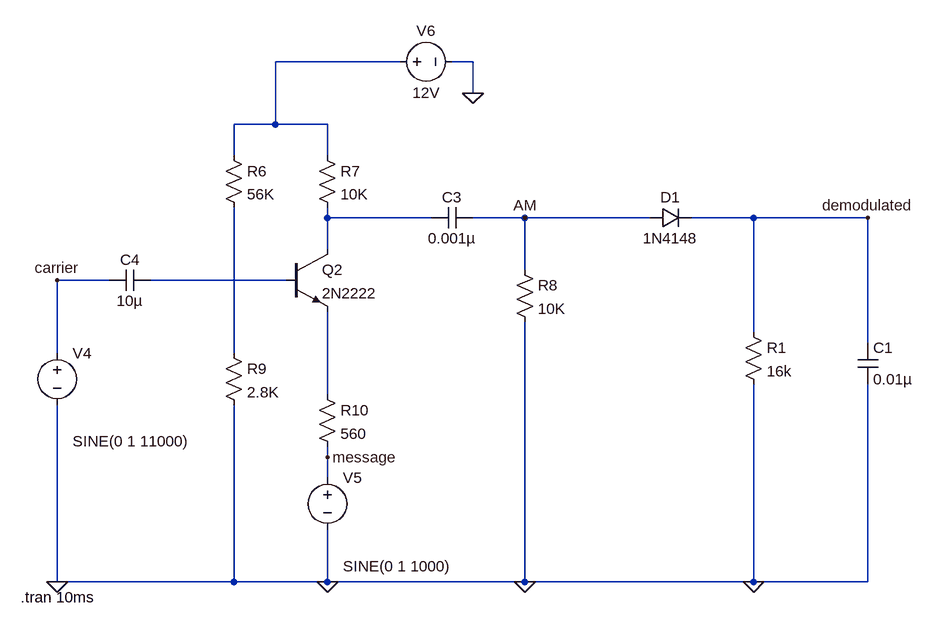
[diagram p0: schematic AM using envelope.asc]
AM using envelope.asc, the LTspice schematic file:
Version 4
SHEET 1 1700 776
WIRE 128 -1488 -64 -1488
WIRE 240 -1488 208 -1488
WIRE 240 -1440 240 -1488
WIRE -64 -1392 -64 -1488
WIRE -64 -1392 -128 -1392
WIRE 16 -1392 -64 -1392
WIRE -128 -1344 -128 -1392
WIRE 16 -1344 16 -1392
WIRE 16 -1248 16 -1264
WIRE 176 -1248 16 -1248
WIRE 320 -1248 240 -1248
WIRE 512 -1248 320 -1248
WIRE 672 -1248 576 -1248
WIRE 848 -1248 672 -1248
WIRE 16 -1200 16 -1248
WIRE 320 -1168 320 -1248
WIRE -320 -1152 -400 -1152
WIRE -48 -1152 -256 -1152
WIRE 672 -1072 672 -1248
WIRE 848 -1056 848 -1248
WIRE -400 -1040 -400 -1152
WIRE -128 -1040 -128 -1264
WIRE 16 -976 16 -1104
WIRE 16 -880 16 -896
WIRE 16 -848 16 -880
WIRE -400 -688 -400 -960
WIRE -128 -688 -128 -960
WIRE -128 -688 -400 -688
WIRE 16 -688 16 -768
WIRE 16 -688 -128 -688
WIRE 320 -688 320 -1088
WIRE 320 -688 16 -688
WIRE 672 -688 672 -992
WIRE 672 -688 320 -688
WIRE 848 -688 848 -992
WIRE 848 -688 672 -688
FLAG 240 -1440 0
FLAG -400 -688 0
FLAG 16 -688 0
FLAG 320 -688 0
FLAG 320 -1248 AM
FLAG 16 -880 message
FLAG -400 -1152 carrier
FLAG 672 -688 0
FLAG 848 -1248 demodulated
SYMBOL res -144 -1360 R0
SYMATTR InstName R6
SYMATTR Value 56K
SYMBOL res 0 -1360 R0
SYMATTR InstName R7
SYMATTR Value 10K
SYMBOL npn -48 -1200 R0
SYMATTR InstName Q2
SYMATTR Value 2N2222
SYMBOL cap 240 -1264 R90
WINDOW 0 0 32 VBottom 2
WINDOW 3 32 32 VTop 2
SYMATTR InstName C3
SYMATTR Value 0.001µ
SYMBOL res 304 -1184 R0
SYMATTR InstName R8
SYMATTR Value 10K
SYMBOL res -144 -1056 R0
SYMATTR InstName R9
SYMATTR Value 2.8K
SYMBOL cap -256 -1168 R90
WINDOW 0 0 32 VBottom 2
WINDOW 3 32 32 VTop 2
SYMATTR InstName C4
SYMATTR Value 10µ
SYMBOL voltage -400 -1056 R0
WINDOW 3 24 152 Left 2
WINDOW 123 24 124 Left 2
WINDOW 39 0 0 Left 0
SYMATTR Value SINE(0 1 11000)
SYMATTR InstName V4
SYMBOL voltage 16 -864 R0
WINDOW 3 24 152 Left 2
WINDOW 123 24 124 Left 2
WINDOW 39 0 0 Left 0
SYMATTR Value SINE(0 1 1000)
SYMATTR InstName V5
SYMBOL res 0 -992 R0
SYMATTR InstName R10
SYMATTR Value 560
SYMBOL voltage 112 -1488 R270
WINDOW 0 32 56 VTop 2
WINDOW 3 -32 56 VBottom 2
WINDOW 123 0 0 Left 0
WINDOW 39 0 0 Left 0
SYMATTR InstName V6
SYMATTR Value 12V
SYMBOL diode 512 -1232 R270
WINDOW 0 32 32 VTop 2
WINDOW 3 0 32 VBottom 2
SYMATTR InstName D1
SYMATTR Value 1N4148
SYMBOL res 656 -1088 R0
SYMATTR InstName R1
SYMATTR Value 16k
SYMBOL cap 832 -1056 R0
SYMATTR InstName C1
SYMATTR Value 0.01µ
TEXT -456 -664 Left 2 !.tran 10ms

The netlist it stands for:
* AM using envelope.asc
R6 N001 N004 56K
R7 N001 N002 10K
Q2 N002 N003 N005 0 2N2222
C3 AM N002 0.001µ
R8 AM 0 10K
R9 N004 0 2.8K
C4 N003 carrier 10µ
V4 carrier 0 SINE(0 1 11000)
V5 message 0 SINE(0 1 1000)
R10 N005 message 560
V6 N001 0 12V
D1 AM demodulated 1N4148
R1 demodulated 0 16k
C1 demodulated 0 0.01µ
.model D D
.lib standard.dio
.model NPN NPN
.model PNP PNP
.lib standard.bjt
.tran 10ms
.backanno
.end